# Altium project Bus_Adaptor_Hw-v2.PrjPcb
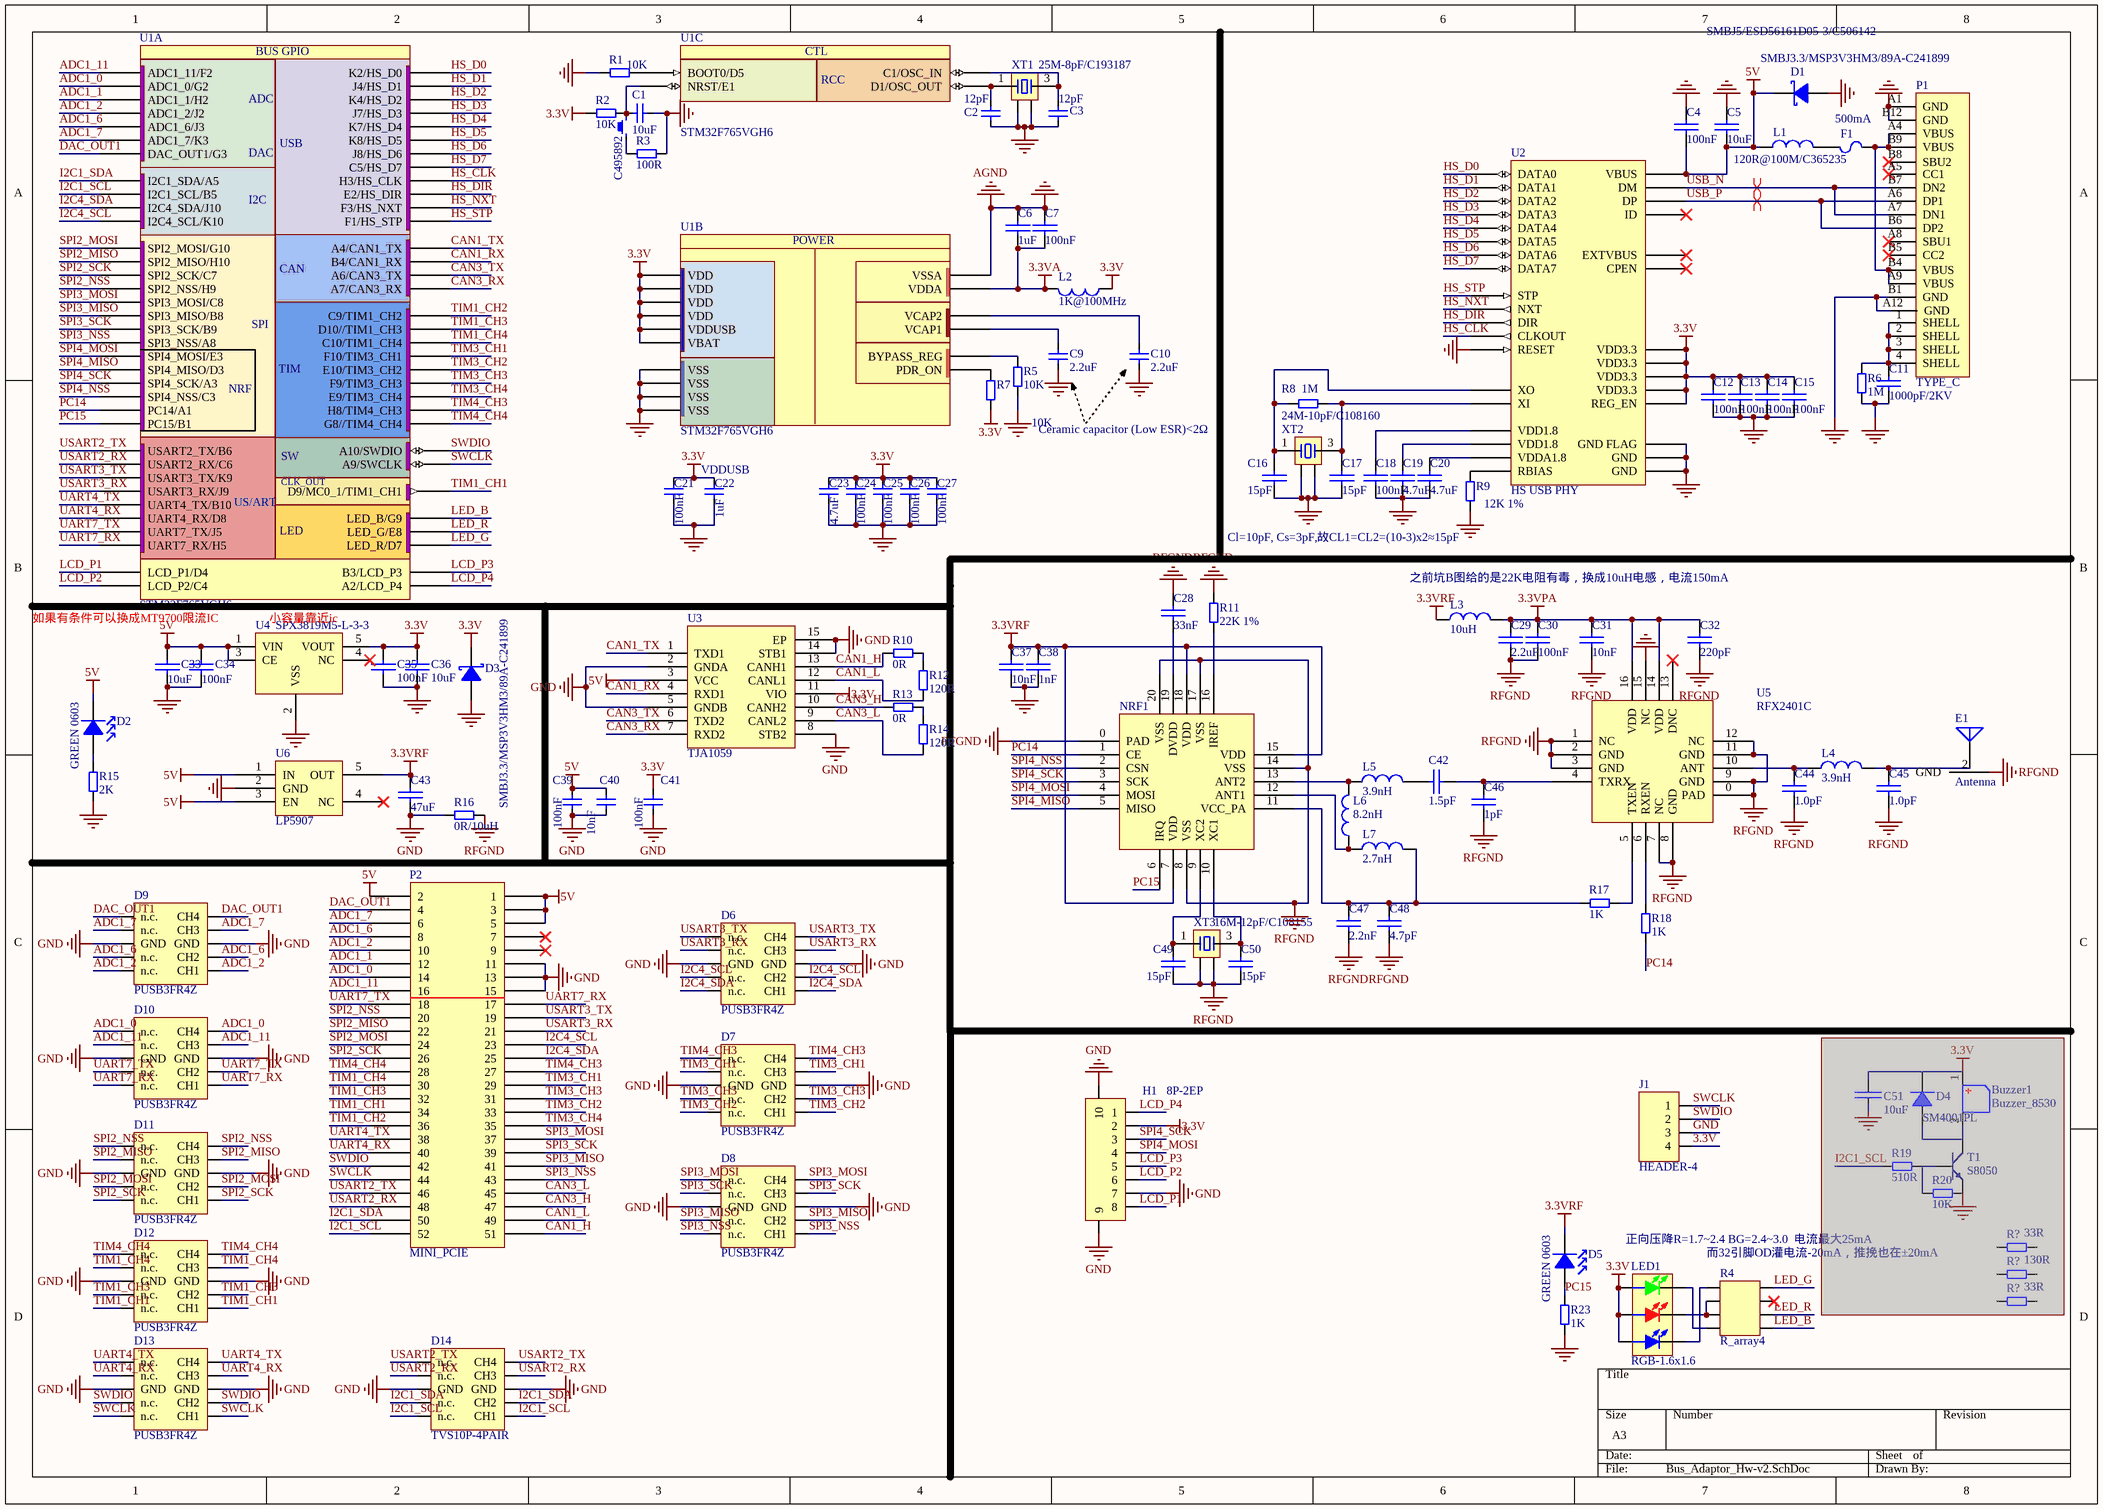
[diagram p0: Bus_Adaptor_Hw-v2.SchDoc]
1 sheet, 115 parts. Net scope: global (net labels, ports and power ports of the same name join across sheets).
Board file: Bus_Adaptor_Hw-v2.2-tvs_tft.PcbDoc

## Sheet Bus_Adaptor_Hw-v2.SchDoc
size A3

### Parts
(Parts that share a designator on the sheet are numbered #1, #2 ... from top to bottom, then left to right.)
Buzzer1  Buzzer_8530  [BUZZER_8530]  (masked out: inside a compile mask, not in the netlist)
C1  10uF  [0402_C]
C2  12pF  [0402_C]
C3  12pF  [0402_C]
C4  100nF  [0402_C]
C5  10uF  [0402_C]
C6  1uF  [0402_C]
C7  100nF  [0402_C]
C9  2.2uF  [0402_C]
C10  2.2uF  [0402_C]
C11  1000pF/2KV  [1206_C]
C12  100nF  [0402_C]
C13  100nF  [0402_C]
C14  100nF  [0402_C]
C15  100nF  [0402_C]
C16  15pF  [0402_C]
C17  15pF  [0402_C]
C18  100nF  [0402_C]
C19  4.7uF  [0402_C]
C20  4.7uF  [0402_C]
C21  100nF  [0402_C]
C22  1uF  [0402_C]
C23  4.7uF  [0402_C]
C24  100nF  [0402_C]
C25  100nF  [0402_C]
C26  100nF  [0402_C]
C27  100nF  [0402_C]
C28  33nF  [0402_C]
C29  2.2uF  [0402_C]
C30  100nF  [0402_C]
C31  10nF  [0402_C]
C32  220pF  [0402_C]
C33  10uF  [0402_C]
C34  100nF  [0402_C]
C35  100nF  [0402_C]
C36  10uF  [0402_C]
C37  10nF  [0402_C]
C38  1nF  [0402_C]
C39  100nF  [0402_C]
C40  10nF  [0402_C]
C41  100nF  [0402_C]
C42  1.5pF  [0402_C]
C43  47uF  [0805_C]
C44  1.0pF  [0402_C]
C45  1.0pF  [0402_C]
C46  1pF  [0402_C]
C47  2.2nF  [0402_C]
C48  4.7pF  [0402_C]
C49  15pF  [0402_C]
C50  15pF  [0402_C]
C51  10uF  [0402_C]  (masked out: inside a compile mask, not in the netlist)
D1  SMBJ3.3/MSP3V3HM3/89A-C241899  [SMA]
D2  GREEN 0603  [0603_LED_S1]
D3  SMBJ3.3/MSP3V3HM3/89A-C241899  [SMA]
D4  SM4001PL  [SOD-123FL]  (masked out: inside a compile mask, not in the netlist)
D5  GREEN 0603  [0603_LED_S1]
D6  PUSB3FR4Z  [DFN2510A-10_L2.5-W1.0-P0.50-BL]
D7  PUSB3FR4Z  [DFN2510A-10_L2.5-W1.0-P0.50-BL]
D8  PUSB3FR4Z  [DFN2510A-10_L2.5-W1.0-P0.50-BL]
D9  PUSB3FR4Z  [DFN2510A-10_L2.5-W1.0-P0.50-BL]
D10  PUSB3FR4Z  [DFN2510A-10_L2.5-W1.0-P0.50-BL]
D11  PUSB3FR4Z  [DFN2510A-10_L2.5-W1.0-P0.50-BL]
D12  PUSB3FR4Z  [DFN2510A-10_L2.5-W1.0-P0.50-BL]
D13  PUSB3FR4Z  [DFN2510A-10_L2.5-W1.0-P0.50-BL]
D14  TVS10P-4PAIR  [DFN2510A-10_L2.5-W1.0-P0.50-BL]
E1  Antenna  [IPEX]
F1  500mA  [0805_R]
H1  8P-2EP  [FPC-SMD_8P-P0.50_F0500WR-S-08PNLNG1GT0R]
J1  HEADER-4  [HDR-1X4]
Key1  C495892  [SW-SMD_侧开/5脚]
L1  120R@100M/C365235  [0805_L]
L2  1K@100MHz  [0603_L]
L3  10uH  [0603_L]
L4  3.9nH  [0402_L]
L5  3.9nH  [0402_L]
L6  8.2nH  [0402_L]
L7  2.7nH  [0402_L]
LED1  RGB-1.6x1.6  [RGB-1.6x1.6]
NRF1  NRF24L01  [QFN-20_4x4x05P]  (value not drawn)
P1  TYPE_C  [TYPE-C-TOP]
P2  MINI_PCIE  [MINIPCIE]
R1  10K  [0402_R]
R2  10K  [0402_R]
R3  100R  [0402_R]
R4  R_array4  [RES-ARRAY-SMD_0201-8P-L1.4-W0.6-BL]
R5  10K  [0402_R]
R6  1M  [0402_R]
R7  10K  [0402_R]
R8  1M  [0402_R]
R9  12K 1%  [0402_R]
R10  0R  [0201]
R11  22K 1%  [0402_R]
R12  120R  [0402_R]
R13  0R  [0201]
R14  120R  [0402_R]
R15  2K  [0402_R]
R16  0R/10uH  [0805_L]
R17  1K  [0402_R]
R18  1K  [0402_R]
R19  510R  [0402_R]  (masked out: inside a compile mask, not in the netlist)
R20  10K  [0402_R]  (masked out: inside a compile mask, not in the netlist)
R23  1K  [0402_R]
R?#1  33R  [0402_R]  (masked out: inside a compile mask, not in the netlist)
R?#2  130R  [0402_R]  (masked out: inside a compile mask, not in the netlist)
R?#3  33R  [0402_R]  (masked out: inside a compile mask, not in the netlist)
T1  S8050  [SOT-23(SOT-23-3)]  (masked out: inside a compile mask, not in the netlist)
U1  STM32F765VGH6  [TFBGA100, 8*8*0.8 mm]  (parts A,B,C of 3)
U2  HS USB PHY  [QFN50P500X500X100-32N]
U3  TJA1059  [HVSON-14_L4.5-W3.0-P0.65-BL-EP]
U4  SPX3819M5-L-3-3  [SOT-23-5]
U5  RFX2401C  [RFX2401C]
U6  LP5907  [SOT-23-5]
XT1  25M-8pF/C193187  [OSC-SMD_4P-L2.0-W1.6-BL]
XT2  24M-10pF/C108160  [OSC-SMD_4P-L2.0-W1.6-BL]
XT3  16M-12pF/C108155  [OSC-SMD_4P-L2.0-W1.6-BL]

### Nets
3.3V: C12.2 C13.2 C14.2 C15.2 C21.2 C22.2 C23.2 C24.2 C25.2 C26.2 C27.2 C35.2 C36.2 C41.1 D3.2(K) H1.2 J1.4 L2.1 LED1.2(A) LED1.4(A) LED1.6(A) R2.1 R7.1 U1.B2(VBAT) U1.D2(VDD) U1.F4(VDD) U1.F5(VDD) U1.F6(VDDUSB) U1.K1(VDD) U2.6(VDD3.3) U2.16(VDD3.3) U2.25(VDD3.3) U2.30(VDD3.3) U2.31(REG_EN) U3.11(VIO) U4.5(VOUT)
3.3VA: C6.1 C7.1 L2.2 U1.H1(VDDA)
3.3VPA: C29.2 C30.2 C31.2 C32.2 L3.2 U5.14(VDD) U5.16(VDD)
3.3VRF: C37.2 C38.2 C43.2 D5.K L3.1 NRF1.7(VDD) NRF1.15(VDD) NRF1.18(VDD) U6.5(OUT)
5V: C4.1 C5.1 C33.2 C34.2 C39.1 C40.1 D1.2(K) D2.K L1.1 P2.1 P2.2 P2.3 P2.5 U2.4(VBUS) U3.3(VCC) U4.1(VIN) U4.3(CE) U6.1(IN) U6.3(EN)
GND: C1.1 C2.1 C3.1 C4.2 C5.2 C6.2 C7.2 C9.2 C10.1 C11.1 C12.1 C13.1 C14.1 C15.1 C16.1 C17.1 C18.1 C19.1 C20.1 C21.1 C22.1 C23.1 C24.1 C25.1 C26.1 C27.1 C33.1 C34.1 C35.1 C36.1 C39.2 C40.2 C41.2 C43.1 D1.1(A) D3.1(A) D6.3(GND) D6.8(GND) D7.3(GND) D7.8(GND) D8.3(GND) D8.8(GND) D9.3(GND) D9.8(GND) D10.3(GND) D10.8(GND) D11.3(GND) D11.8(GND) D12.3(GND) D12.8(GND) D13.3(GND) D13.8(GND) D14.3(GND) D14.8(GND) H1.7 H1.9 H1.10 J1.3 P1.A1(GND) P1.A12(GND) P1.B1(GND) P1.B12(GND) P2.11 P2.13 P2.15 R1.1 R3.2 R5.1 R6.1 R9.1 R15.1 R16.2 U1.C2(VSS) U1.E4(VSS) U1.E5(VSS) U1.G1(VSSA) U1.J1(VSS) U2.0(GND_FLAG) U2.1(GND) U2.2(GND) U2.9(RESET) U3.2(GNDA) U3.5(GNDB) U3.8(STB2) U3.14(STB1) U3.15(EP) U4.2(VSS) U6.2(GND) XT1.2 XT1.4 XT2.2 XT2.4  [also labelled AGND]
RFGND: C28.2 C29.1 C30.1 C31.1 C32.1 C37.1 C38.1 C44.1 C45.1 C46.1 C47.1 C48.1 C49.1 C50.1 E1.2(GND) NRF1.0(PAD) NRF1.8(VSS) NRF1.14(VSS) NRF1.17(VSS) NRF1.20(VSS) R11.2 R16.1 R23.1 U5.0(PAD) U5.1(NC) U5.2(GND) U5.3(GND) U5.7(NC) U5.8(GND) U5.9(GND) U5.11(GND) U5.12(NC) U5.15(NC) XT3.2 XT3.4
ADC1_0: D10.5(CH4) D10.6(n.c.) P2.14 U1.G2(ADC1_0/G2)
ADC1_1: P2.12 U1.H2(ADC1_1/H2)
ADC1_2: D9.1(CH1) D9.10(n.c.) P2.10 U1.J2(ADC1_2/J2)
ADC1_6: D9.2(CH2) D9.9(n.c.) P2.8 U1.J3(ADC1_6/J3)
ADC1_7: D9.4(CH3) D9.7(n.c.) P2.6 U1.K3(ADC1_7/K3)
ADC1_11: D10.4(CH3) D10.7(n.c.) P2.16 U1.F2(ADC1_11/F2)
CAN1_H: P2.51 R10.1 U3.13(CANH1)
CAN1_L: P2.49 R12.2 U3.12(CANL1)
CAN1_RX: U1.B4(B4/CAN1_RX) U3.4(RXD1)
CAN1_TX: U1.A4(A4/CAN1_TX) U3.1(TXD1)
CAN3_H: P2.47 R13.1 U3.10(CANH2)
CAN3_L: P2.45 R14.2 U3.9(CANL2)
CAN3_RX: U1.A7(A7/CAN3_RX) U3.7(RXD2)
CAN3_TX: U1.A6(A6/CAN3_TX) U3.6(TXD2)
DAC_OUT1: D9.5(CH4) D9.6(n.c.) P2.4 U1.G3(DAC_OUT1/G3)
HS_CLK: U1.H3(H3/HS_CLK) U2.14(CLKOUT)
HS_D0: U1.K2(K2/HS_D0) U2.24(DATA0)
HS_D1: U1.J4(J4/HS_D1) U2.23(DATA1)
HS_D2: U1.K4(K4/HS_D2) U2.22(DATA2)
HS_D3: U1.J7(J7/HS_D3) U2.21(DATA3)
HS_D4: U1.K7(K7/HS_D4) U2.20(DATA4)
HS_D5: U1.K8(K8/HS_D5) U2.19(DATA5)
HS_D6: U1.J8(J8/HS_D6) U2.18(DATA6)
HS_D7: U1.C5(C5/HS_D7) U2.17(DATA7)
HS_DIR: U1.E2(E2/HS_DIR) U2.12(DIR)
HS_NXT: U1.F3(F3/HS_NXT) U2.11(NXT)
HS_STP: U1.F1(F1/HS_STP) U2.13(STP)
I2C1_SCL: D14.1(CH1) D14.10(n.c.) P2.52 U1.B5(I2C1_SCL/B5)
I2C1_SDA: D14.2(CH2) D14.9(n.c.) P2.50 U1.A5(I2C1_SDA/A5)
I2C4_SCL: D6.2(CH2) D6.9(n.c.) P2.23 U1.K10(I2C4_SCL/K10)
I2C4_SDA: D6.1(CH1) D6.10(n.c.) P2.25 U1.J10(I2C4_SDA/J10)
LCD_P1: H1.8 U1.D4(LCD_P1/D4)
LCD_P2: H1.6 U1.C4(LCD_P2/C4)
LCD_P3: H1.5 U1.B3(B3/LCD_P3)
LCD_P4: H1.1 U1.A2(A2/LCD_P4)
LED_B: R4.5 U1.G9(LED_B/G9)
LED_G: R4.8 U1.D7(LED_R/D7)
LED_R: R4.6 U1.E8(LED_G/E8)
PC14: NRF1.1(CE) R18.1 U1.A1(PC14/A1)
PC15: D5.A NRF1.6(IRQ) R23.2 U1.B1(PC15/B1)
SPI2_MISO: D11.4(CH3) D11.7(n.c.) P2.22 U1.H10(SPI2_MISO/H10)
SPI2_MOSI: D11.2(CH2) D11.9(n.c.) P2.24 U1.G10(SPI2_MOSI/G10)
SPI2_NSS: D11.5(CH4) D11.6(n.c.) P2.20 U1.H9(SPI2_NSS/H9)
SPI2_SCK: D11.1(CH1) D11.10(n.c.) P2.26 U1.C7(SPI2_SCK/C7)
SPI3_MISO: D8.2(CH2) D8.9(n.c.) P2.41 U1.B8(SPI3_MISO/B8)
SPI3_MOSI: D8.5(CH4) D8.6(n.c.) P2.37 U1.C8(SPI3_MOSI/C8)
SPI3_NSS: D8.1(CH1) D8.10(n.c.) P2.43 U1.A8(SPI3_NSS/A8)
SPI3_SCK: D8.4(CH3) D8.7(n.c.) P2.39 U1.B9(SPI3_SCK/B9)
SPI4_MISO: NRF1.5(MISO) U1.D3(SPI4_MISO/D3)
SPI4_MOSI: H1.4 NRF1.4(MOSI) U1.E3(SPI4_MOSI/E3)
SPI4_NSS: NRF1.2(CSN) U1.C3(SPI4_NSS/C3)
SPI4_SCK: H1.3 NRF1.3(SCK) U1.A3(SPI4_SCK/A3)
SWCLK: D13.1(CH1) D13.10(n.c.) J1.1 P2.44 U1.A9(A9/SWCLK)
SWDIO: D13.2(CH2) D13.9(n.c.) J1.2 P2.42 U1.A10(A10/SWDIO)
TIM1_CH1: D12.1(CH1) D12.10(n.c.) P2.34 U1.D9(D9/MC0_1/TIM1_CH1)
TIM1_CH2: P2.36 U1.C9(C9/TIM1_CH2)
TIM1_CH3: D12.2(CH2) D12.9(n.c.) P2.32 U1.D10(D10//TIM1_CH3)
TIM1_CH4: D12.4(CH3) D12.7(n.c.) P2.30 U1.C10(C10/TIM1_CH4)
TIM3_CH1: D7.4(CH3) D7.7(n.c.) P2.29 U1.F10(F10/TIM3_CH1)
TIM3_CH2: D7.1(CH1) D7.10(n.c.) P2.33 U1.E10(E10/TIM3_CH2)
TIM3_CH3: D7.2(CH2) D7.9(n.c.) P2.31 U1.F9(F9/TIM3_CH3)
TIM3_CH4: P2.35 U1.E9(E9/TIM3_CH4)
TIM4_CH3: D7.5(CH4) D7.6(n.c.) P2.27 U1.H8(H8/TIM4_CH3)
TIM4_CH4: D12.5(CH4) D12.6(n.c.) P2.28 U1.G8(G8//TIM4_CH4)
UART4_RX: D13.4(CH3) D13.7(n.c.) P2.40 U1.D8(UART4_RX/D8)
UART4_TX: D13.5(CH4) D13.6(n.c.) P2.38 U1.B10(UART4_TX/B10)
UART7_RX: D10.1(CH1) D10.10(n.c.) P2.17 U1.H5(UART7_RX/H5)
UART7_TX: D10.2(CH2) D10.9(n.c.) P2.18 U1.J5(UART7_TX/J5)
USART2_RX: D14.4(CH3) D14.7(n.c.) P2.48 U1.C6(USART2_RX/C6)
USART2_TX: D14.5(CH4) D14.6(n.c.) P2.46 U1.B6(USART2_TX/B6)
USART3_RX: D6.4(CH3) D6.7(n.c.) P2.21 U1.J9(USART3_RX/J9)
USART3_TX: D6.5(CH4) D6.6(n.c.) P2.19 U1.K9(USART3_TX/K9)
USB_N: P1.A7(DN1) P1.B7(DN2) U2.8(DM)
USB_P: P1.A6(DP1) P1.B6(DP2) U2.7(DP)
NetC1_2: C1.2 Key1.2 R2.2 U1.E1(NRST/E1)
NetC2_2: C2.2 U1.D1(D1/OSC_OUT) XT1.1
NetC3_2: C3.2 U1.C1(C1/OSC_IN) XT1.3
NetC9_1: C9.1 U1.F8(VCAP1)
NetC10_2: C10.2 U1.E7(VCAP2)
NetC11_2: C11.2 P1.1(SHELL) P1.2(SHELL) P1.3(SHELL) P1.4(SHELL) R6.2
NetC16_2: C16.2 R8.1 U2.27(XO) XT2.1
NetC17_2: C17.2 R8.2 U2.28(XI) XT2.3
NetC18_2: C18.2 U2.15(VDD1.8)
NetC19_2: C19.2 U2.26(VDD1.8)
NetC20_2: C20.2 U2.29(VDDA1.8)
NetC28_1: C28.1 NRF1.19(DVDD)
NetC42_1: C42.1 C46.2 U5.4(TXRX)
NetC42_2: C42.2 L5.2
NetC44_2: C44.2 L4.1 U5.10(ANT)
NetC45_2: C45.2 E1.1(ANT) L4.2
NetC47_2: C47.2 C48.2 L7.2 NRF1.11(VCC_PA) R17.2
NetC49_2: C49.2 NRF1.9(XC2) XT3.1
NetC50_2: C50.2 NRF1.10(XC1) XT3.3
NetD2_A: D2.A R15.2
NetF1_1: F1.1 L1.2
NetF1_2: F1.2 P1.A4(VBUS) P1.A9(VBUS) P1.B4(VBUS) P1.B9(VBUS)
NetKey1_1: Key1.1 R3.1
NetL5_1: L5.1 L6.2 NRF1.13(ANT2)
NetL6_1: L6.1 L7.1 NRF1.12(ANT1)
NetLED1_1: LED1.1(GREEN_K) R4.4
NetLED1_3: LED1.3(RED_K) R4.2 R4.3
NetLED1_5: LED1.5(BULE_K) R4.1
NetNRF1_16: NRF1.16(IREF) R11.1
NetR1_2: R1.2 U1.D5(BOOT0/D5)
NetR5_2: R5.2 U1.E6(BYPASS_REG)
NetR7_2: R7.2 U1.F7(PDR_ON)
NetR9_2: R9.2 U2.32(RBIAS)
NetR10_2: R10.2 R12.1
NetR13_2: R13.2 R14.1
NetR17_1: R17.1 U5.5(TXEN)
NetR18_2: R18.2 U5.6(RXEN)

Not connected (* = marked no-connect by the designer): P1 A5(CC1)* A8(SBU1)* B5(CC2)* B8(SBU2)*; P2 7* 9*; R4 7*; U2 3(CPEN)* 5(ID)* 10(EXTVBUS)*; U4 4(NC)*; U5 13(DNC)*; U6 4(NC)*

### Layout directives
differential pair: USB_N, USB_P

### Notes on the sheet
- SMBJ5/ESD56161D05-3/C506142
- Ceramic capacitor (Low ESR)<2Ω
- (near C22) VDDUSB
- Cl=10pF, Cs=3pF,故CL1=CL2=(10-3)x2≈15pF
- 之前坑B图给的是22K电阻有毒，换成10uH电感，电流150mA
- 如果有条件可以换成MT9700限流IC
- 小容量靠近ic
- 正向压降R=1.7~2.4 BG=2.4~3.0  电流最大25mA
- (near R4) 而32引脚OD灌电流-20mA，推挽也在±20mA
- (in symbol STM32F765VGH6, part A) BUS GPIO; ADC; USB; DAC; I2C; CAN; SPI; TIM; NRF; SW; CLK_OUT; US/ART; LED
- (in symbol STM32F765VGH6, part B) POWER
- (in symbol STM32F765VGH6, part C) CTL; RCC

### Library data of the parts
Buzzer1 = Buzzer_8530: 无源蜂鸣器
C1-C7 C9-C51 = C
D1 D3 = TVS: BV03CW
D2 D5 = LED
D4 = Diode: 二极管; 备注: 1N4007 4007 编号C2464 已经停售, 使用新物料编号C95872; ComponentLink1Description: 供应商链接; ComponentLink1URL: http://www.szlcsc.com/product/details_2841.html; Package: SMA(DO-214AC); Supplier: LC; SuppliersPartNumber: C95872
D6-D14 = TVS10P-4PAIR: C503418
E1 = Antenna: Generic Antenna; Published: 24-Mar-1999; LatestRevisionDate: 17-Jul-2002; LatestRevisionNote: Re-released for DXP Platform.; PackageReference: PIN1; Publisher: Altium Limited
F1 = FUSE
H1 = 8P-2EP: FPC-8P
Key1 = KEY
L1-L7 = L
LED1 = LED-RGB 3528: 3528三基色LED
P1 = USB_C
R1-R3 R5-R20 R23 R?#1-R?#3 = R: resistor
T1 = Triode: NPN
U1 = STM32F765VGH6: Internal RAM: 192kB; Operating Frequency (Processor Speed): 168MHz; A/D Converter: 16x12-bit; D/A Converter: 2x12-bit; 16-bit Timers (IC/OC/PWM): 12x16-bit(24/24/30); 32-bit Timer (IC/OC/PWM): 2x32-bit (8/8/8); Other Timer Functions: 2xWDG, RTC, 24-bit down counter; Serial Interface: 3xSPI/2xI2S/2xI2C/3xUSART(IrDa, ISO7816)/3xUART/2xUSB OTG FS/HS, 2xCAN/Ethernet MAC10/100, SDIO; DatasheetVersion: rev2, Jan-2012; PackageVersion: 2012; PackageReference: LQFP100; PackageDescription: 100-Pin Low Profile Quad Flat Package, 14x14 mm Body, 0.5 mm Pitch; ComponentLink1Description: Manufacturer URL; ComponentLink1URL: http://www.st.com/; ComponentLink2Description: STM32F405/7 Datasheet; ComponentLink2URL: http://www.st.com/internet/com/TECHNICAL_RESOURCES/TECHNICAL_LITERATURE/DATASHEET/DM00037051.pdf; ComponentLink3Description: STM32F4 Web Page; ComponentLink3URL: http://www.st.com/internet/mcu/subclass/1521.jsp
U2 = USB3300: 高速USB外置PHY
U3 = TJA1059: double can
U4 = ME6211
XT1-XT3 = XTAL-4P: 4脚无源晶振